# EasyEDA schematic EasyEDA file_SCH_Meshtastic_ESP32_RA01SH_v1_2026-02-05.json
TITLE: Sheet_1; REV: 1.0; Date: 2026-02-01; Sheet: 1/1; Drawn By: Azizur Rahman; Company: Your Company
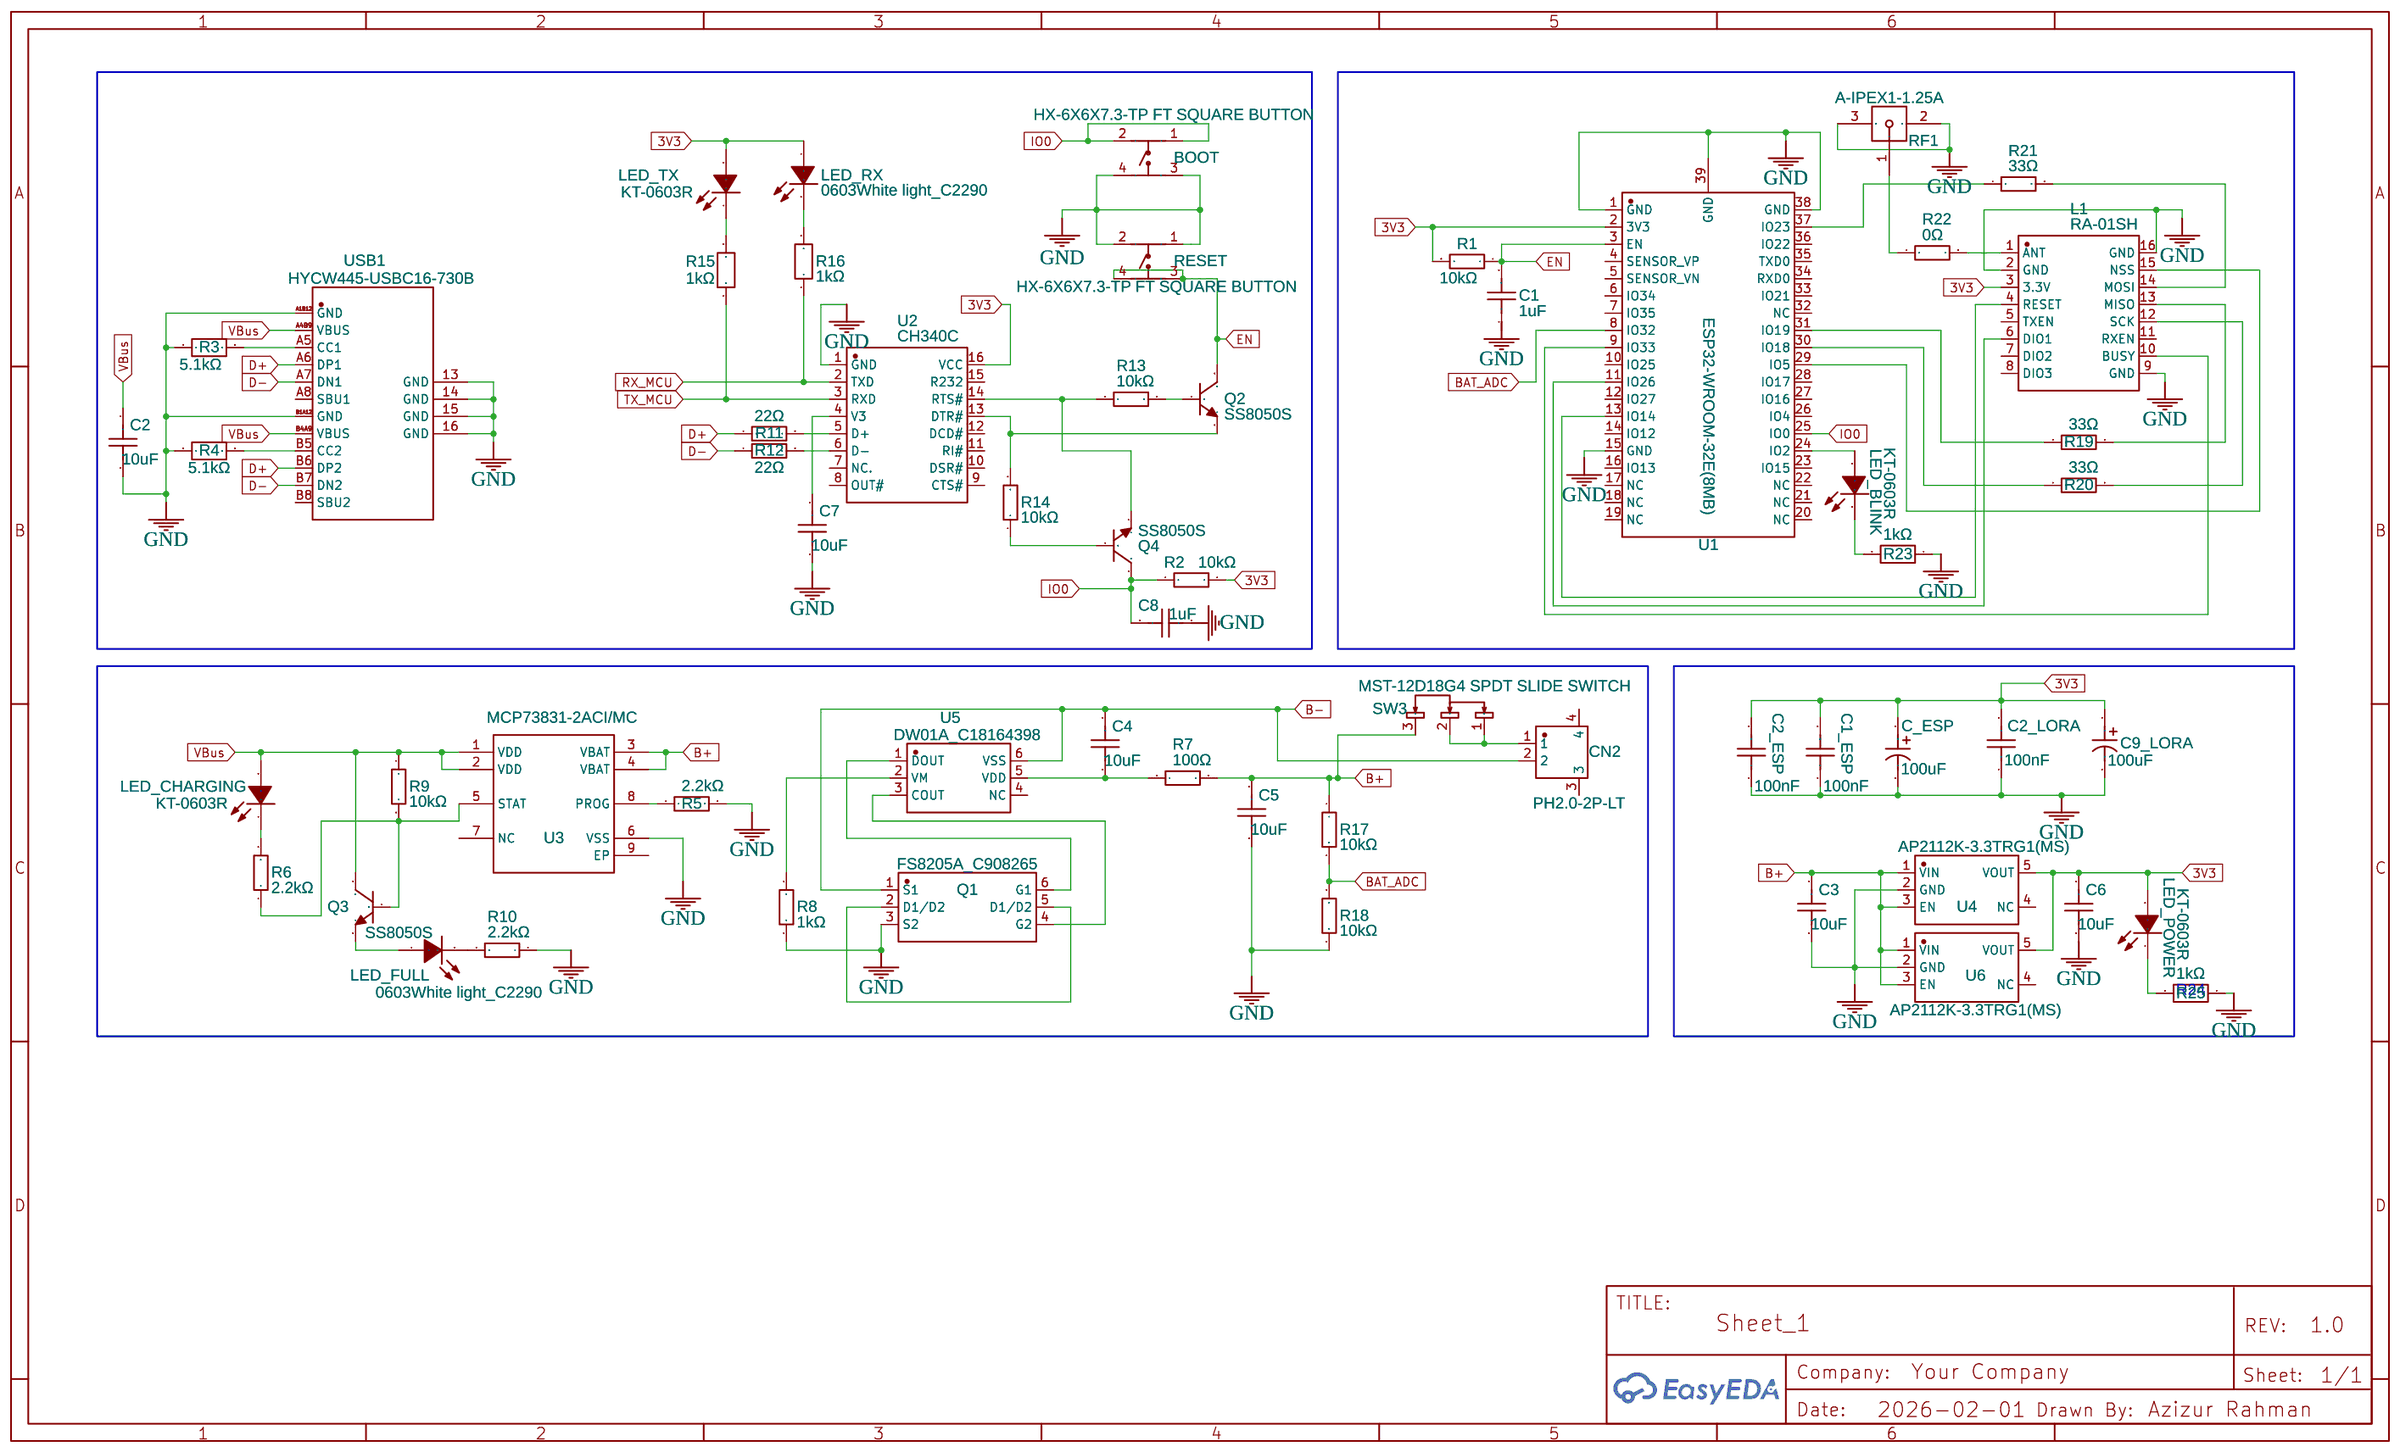
[diagram p0: schematic sheet]

## Parts
BOOT  HX-6X6X7.3-TP FT SQUARE BUTTON  [SW-SMD_4P-L6.0-W6.0-P4.50-LS9.0-H7.3]
C1  1uF  [C0603]
C1_ESP  100nF  [C0603]
C2  10uF  [C0603]
C2_ESP  100nF  [C0603]
C2_LORA  100nF  [C0603]
C3  10uF  [C0603]
C4  10uF  [C0603]
C5  10uF  [C0603]
C6  10uF  [C0603]
C7  10uF  [C0603]
C8  1uF  [C0603]
C9_LORA  100uF  [CAP-SMD_BD6.3-L6.6-W6.6-LS7.2-FD-1]
C_ESP  100uF  [CAP-SMD_BD6.3-L6.6-W6.6-LS7.2-FD-1]
CN2  PH2.0-2P-LT  [CONN-SMD_PH2.0-1X2PW]
L1  RA-01SH  [WIRELM-SMD_RA-01SH]
LED_BLINK  KT-0603R  [LED0603-RD]
LED_CHARGING  KT-0603R  [LED0603-RD]
LED_FULL  0603White light_C2290  [LED0603-R-RD_WHITE]
LED_POWER  KT-0603R  [LED0603-RD]
LED_RX  0603White light_C2290  [LED0603-R-RD_WHITE]
LED_TX  KT-0603R  [LED0603-RD]
Q1  FS8205A_C908265  [SOT-23-6_L2.9-W1.6-P0.95-LS2.8-BR]
Q2  SS8050S  [SOT-23-3_L2.9-W1.3-P0.95-LS2.4-BR]
Q3  SS8050S  [SOT-23-3_L2.9-W1.3-P0.95-LS2.4-BR]
Q4  SS8050S  [SOT-23-3_L2.9-W1.3-P0.95-LS2.4-BR]
R1  10kΩ  [R0603]
R2  10kΩ  [R0603]
R3  5.1kΩ  [R0603]
R4  5.1kΩ  [R0603]
R5  2.2kΩ  [R0603]
R6  2.2kΩ  [R0603]
R7  100Ω  [R0603]
R8  1kΩ  [R0603]
R9  10kΩ  [R0603]
R10  2.2kΩ  [R0603]
R11  22Ω  [R1206]
R12  22Ω  [R1206]
R13  10kΩ  [R0603]
R14  10kΩ  [R0603]
R15  1kΩ  [R1206]
R16  1kΩ  [R1206]
R17  10kΩ  [R0603]
R18  10kΩ  [R0603]
R19  33Ω  [R0603]
R20  33Ω  [R0603]
R21  33Ω  [R0603]
R22  0Ω  [R0805]
R23  1kΩ  [R1206]
R25  1kΩ  [R1206]
RESET  HX-6X6X7.3-TP FT SQUARE BUTTON  [SW-SMD_4P-L6.0-W6.0-P4.50-LS9.0-H7.3]
RF1  A-IPEX1-1.25A  [IPEX-SMD_3P-L2.6-W2.6-LS3.0_RF1200001R]
SW3  MST-12D18G4 SPDT SLIDE SWITCH  [SW-SMD_MST-12D18G4-SPDT-SLIDE-SWITCH]
U1  ESP32-WROOM-32E(8MB)  [WIFI-SMD_ESP32-WROOM-32E]
U2  CH340C  [SOP-16_L10.0-W3.9-P1.27-LS6.0-BL]
U3  MCP73831-2ACI/MC  [TDFN-8_L3.0-W2.0-P0.50-BL-EP1.6]
U4  AP2112K-3.3TRG1(MS)  [SOT-23-5_L2.9-W1.6-P0.95-LS2.7-BR]
U5  DW01A_C18164398  [SOT-23-6_L2.9-W1.6-P0.95-LS2.8-BR]
U6  AP2112K-3.3TRG1(MS)  [SOT-23-5_L2.9-W1.6-P0.95-LS2.7-BR]
USB1  HYCW445-USBC16-730B  [USB-TYPE-C-SMD_TYPE-C-16P-USB616FC]

## Library data of the parts
BOOT RESET = HX-6X6X7.3-TP FT SQUARE BUTTON: Supplier: LCSC; Supplier Part: C49234152; Manufacturer: hanxia(韩下); Manufacturer Part: HX-6x6x7.3-TP FT square button; JLCPCB Part Class: Extended Part; Contributor: lcsc
C1 C8 = CL10A105KB8NNNC: Supplier: LCSC; Manufacturer: SAMSUNG(三星); Supplier Part: C15849; JLCPCB Part Class: Basic Part
C1_ESP C2_ESP C2_LORA = CL10B104KA8WPNC: Supplier: LCSC; Supplier Part: C346190; Manufacturer: SAMSUNG(三星); JLCPCB Part Class: Extended Part; Contributor: lcsc
C2-C7 = CL10A106KP8NNNC: Supplier: LCSC; Manufacturer: SAMSUNG(三星); Supplier Part: C19702; JLCPCB Part Class: Basic Part
C9_LORA C_ESP = RVT100UF16V67RV0120: Contributor: LCSC; Supplier: LCSC; Supplier Part: C2895282; Manufacturer: KNSCHA(科尼盛); JLCPCB Part Class: Extended Part
CN2 = PH2.0-2P-LT: Contributor: LCSC; Supplier: LCSC; Supplier Part: C722761; Manufacturer: CAX(创都); JLCPCB Part Class: Extended Part
L1 = RA-01SH: Contributor: LCSC; Supplier: LCSC; Supplier Part: C2764087; Manufacturer: Ai-Thinker(安信可); Manufacturer Part: Ra-01SH; JLCPCB Part Class: Extended Part
LED_BLINK LED_CHARGING LED_POWER LED_TX = KT-0603R: Supplier: LCSC; Manufacturer: KENTO; Supplier Part: C2286; JLCPCB Part Class: Basic Part
LED_FULL LED_RX = 0603White light_C2290: Supplier: LCSC; Manufacturer: KENTO; Manufacturer Part: KT-0603W; Supplier Part: C2290; JLCPCB Part Class: Basic Part
Q1 = FS8205A_C908265: Contributor: LCSC; JLCPCB Part Class: Extended Part; Supplier: LCSC; Supplier Part: C908265; Manufacturer: FUXINSEMI(富芯森美); Manufacturer Part: FS8205A
Q2-Q4 = SS8050S: Supplier: LCSC; Supplier Part: C22395784; Manufacturer: FOSAN(富捷/富信); JLCPCB Part Class: Extended Part; Contributor: lcsc
R1 R2 R9 R13 R14 R17 R18 = 0603WAF1002T5E: Supplier: LCSC; Manufacturer: UNI-ROYAL(厚声); Supplier Part: C25804; JLCPCB Part Class: Basic Part
R3 R4 = SCR0603F5K1: Supplier: LCSC; Supplier Part: C3016319; Manufacturer: VO(翔胜); JLCPCB Part Class: Extended Part; Contributor: lcsc
R5 R6 R10 = 0603WAF2201T5E: Supplier: LCSC; Manufacturer: UNI-ROYAL(厚声); Supplier Part: C4190; JLCPCB Part Class: Basic Part
R7 = 0603WAF1000T5E: Supplier: LCSC; Manufacturer: UNI-ROYAL(厚声); Supplier Part: C22775; JLCPCB Part Class: Basic Part
R8 = 0603WAF1001T5E: Supplier: LCSC; Manufacturer: UNI-ROYAL(厚声); Supplier Part: C21190; JLCPCB Part Class: Basic Part
R11 R12 = CR1206J40220G: Supplier: LCSC; Manufacturer: LIZ(丽智电子); Supplier Part: C102307; JLCPCB Part Class: Extended Part
R15 R16 R23 R25 = FRC1206J102 TS: Supplier: LCSC; Supplier Part: C2907440; Manufacturer: FOJAN(富捷); Contributor: lcsc; JLCPCB Part Class: Extended Part
R19-R21 = 0603WAF330JT5E: Supplier: LCSC; Manufacturer: UNI-ROYAL(厚声); Supplier Part: C23140; JLCPCB Part Class: Basic Part
R22 = 0805W8J0000T5E: Supplier: LCSC; Manufacturer: UNI-ROYAL(厚声); Supplier Part: C25275; JLCPCB Part Class: Extended Part
RF1 = A-IPEX1-1.25A: Supplier: LCSC; Supplier Part: C22467595; Manufacturer: MyAntenna(摩天射频); JLCPCB Part Class: Extended Part; Contributor: lcsc
SW3 = MST-12D18G4 SPDT SLIDE SWITCH: Supplier: LCSC; Supplier Part: C49023767; Manufacturer: SHOU HAN(首韩); Manufacturer Part: MST-12D18G4 SPDT Slide Switch; JLCPCB Part Class: Extended Part; Contributor: lcsc
U1 = ESP32-WROOM-32E(8MB): Contributor: LCSC; Supplier: LCSC; Supplier Part: C701342; Manufacturer: ESPRESSIF(乐鑫); Manufacturer Part: ESP32-WROOM-32E-N8; JLCPCB Part Class: Extended Part
U2 = CH340C: Supplier: LCSC; Manufacturer: WCH(南京沁恒); Supplier Part: C84681; JLCPCB Part Class: Extended Part
U3 = MCP73831-2ACI/MC: Contributor: LCSC; Supplier: LCSC; Manufacturer: MICROCHIP(美国微芯); Supplier Part: C150772; JLCPCB Part Class: Extended Part
U4 U6 = AP2112K-3.3TRG1(MS): Supplier: LCSC; Supplier Part: C22365427; Manufacturer: MSKSEMI(美森科); JLCPCB Part Class: Extended Part; Contributor: lcsc
U5 = DW01A_C18164398: Supplier: LCSC; Supplier Part: C18164398; Manufacturer: HL(富海微); Manufacturer Part: DW01A; Contributor: lcsc; JLCPCB Part Class: Extended Part
USB1 = HYCW445-USBC16-730B: Supplier: LCSC; Supplier Part: C42400246; Manufacturer: 华宇创; Contributor: lcsc; JLCPCB Part Class: Extended Part

## Nets
3V3: C1_ESP.2 C2_ESP.2 C2_LORA.2 C6.1 C9_LORA.1 C_ESP.1 L1.3(3.3V) LED_POWER.2(A) LED_RX.1(A) LED_TX.2(A) R1.2 R2.1 U1.2(3V3) U2.16(VCC) U4.5(VOUT) U6.5(VOUT)
GND: BOOT.3(C) BOOT.4(D) C1.1 C1_ESP.1 C2.2 C2_ESP.1 C2_LORA.1 C3.2 C5.2 C6.2 C7.2 C8.1 C9_LORA.2 C_ESP.2 L1.2(GND) L1.9(GND) L1.16(GND) Q1.3(S2) R3.1 R4.1 R5.2 R8.2 R10.1 R18.2 R23.1 R25.1 RESET.1(A) RESET.2(B) RF1.2 RF1.3 U1.1(GND) U1.15(GND) U1.38(GND) U1.39(GND) U2.1(GND) U3.6(VSS) U4.2(GND) U6.2(GND) USB1.13(GND) USB1.14(GND) USB1.15(GND) USB1.16(GND) USB1.A1B12(GND) USB1.B1A12(GND)
VBus: C2.1 LED_CHARGING.2(A) Q3.3(C) R9.1 U3.1(VDD) U3.2(VDD) USB1.A4B9(VBUS) USB1.B4A9(VBUS)
B+: C3.1 C5.1 R7.2 R17.1 SW3.3 U3.3(VBAT) U3.4(VBAT) U4.1(VIN) U4.3(EN) U6.1(VIN) U6.3(EN)
B-: C4.1 CN2.2 Q1.1(S1) U5.6(VSS)
BAT_ADC: R17.2 R18.1 U1.8(IO32)
D+: R11.1 USB1.A6(DP1) USB1.B6(DP2)
D-: R12.1 USB1.A7(DN1) USB1.B7(DN2)
EN: C1.2 Q2.3(C) R1.1 RESET.3(C) RESET.4(D) U1.3(EN)
IO0: BOOT.1(A) BOOT.2(B) C8.2 Q4.3(C) R2.2 U1.25(IO0)
RX_MCU: R16.1 U2.2(TXD)
TX_MCU: R15.1 U2.3(RXD)
Net-(C4-2): C4.2 R7.1 U5.5(VDD)
Net-(C7-1): C7.1 U2.4(V3)
Net-(CN2-1): CN2.1 SW3.1 SW3.2
Net-(L1-1): L1.1(ANT) R22.2
Net-(L1-4): L1.4(RESET) U1.13(IO14)
Net-(L1-6): L1.6(DIO1) U1.11(IO26)
Net-(L1-10): L1.10(BUSY) U1.9(IO33)
Net-(L1-12): L1.12(SCK) R20.2
Net-(L1-13): L1.13(MISO) R19.2
Net-(L1-14): L1.14(MOSI) R21.2
Net-(L1-15): L1.15(NSS) U1.29(IO5)
Net-(LED_BLINK-1): LED_BLINK.1(K) R23.2
Net-(LED_BLINK-2): LED_BLINK.2(A) U1.24(IO2)
Net-(LED_CHARGING-1): LED_CHARGING.1(K) R6.2
Net-(LED_FULL-1): LED_FULL.1(A) Q3.2(E)
Net-(LED_FULL-2): LED_FULL.2(K) R10.2
Net-(LED_POWER-1): LED_POWER.1(K) R25.2
Net-(LED_RX-2): LED_RX.2(K) R16.2
Net-(LED_TX-1): LED_TX.1(K) R15.2
Net-(Q1-2): Q1.2(D1/D2) Q1.5(D1/D2)
Net-(Q1-4): Q1.4(G2) U5.3(COUT)
Net-(Q1-6): Q1.6(G1) U5.1(DOUT)
Net-(Q2-1): Q2.1(B) R13.2
Net-(Q2-2): Q2.2(E) R14.2 U2.13(DTR#)
Net-(Q3-1): Q3.1(B) R6.1 R9.2 U3.5(STAT)
Net-(Q4-1): Q4.1(B) R14.1
Net-(Q4-2): Q4.2(E) R13.1 U2.14(RTS#)
Net-(R3-2): R3.2 USB1.A5(CC1)
Net-(R4-2): R4.2 USB1.B5(CC2)
Net-(R5-1): R5.1 U3.8(PROG)
Net-(R8-1): R8.1 U5.2(VM)
Net-(R11-2): R11.2 U2.5(D+)
Net-(R12-2): R12.2 U2.6(D-)
Net-(R19-1): R19.1 U1.31(IO19)
Net-(R20-1): R20.1 U1.30(IO18)
Net-(R21-1): R21.1 U1.37(IO23)
Net-(R22-1): R22.1 RF1.1

Not connected (* = marked no-connect by the designer): CN2 3 4; L1 5(TXEN) 7(DIO2) 8(DIO3) 11(RXEN); U1 4(SENSOR_VP) 5(SENSOR_VN) 6(IO34) 7(IO35) 10(IO25) 12(IO27) 14(IO12) 16(IO13) 17(NC) 18(NC) 19(NC) 20(NC) 21(NC) 22(NC) 23(IO15) 26(IO4) 27(IO16) 28(IO17) 32(NC) 33(IO21) 34(RXD0) 35(TXD0) 36(IO22); U2 7(NC.) 8(OUT#) 9(CTS#) 10(DSR#) 11(RI#) 12(DCD#) 15(R232); U3 7(NC) 9(EP); U4 4(NC); U5 4(NC); U6 4(NC); USB1 A8(SBU1) B8(SBU2)

## Notes on the sheet
- R24
